# EAGLE design ChristmasOrnament (EAGLE 9.4.1)
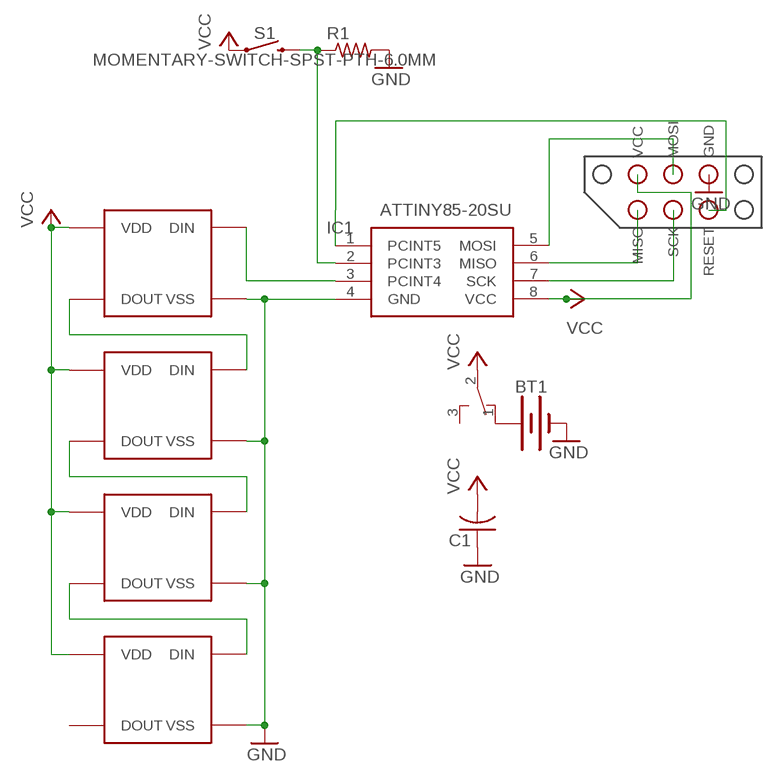
[diagram p0: schematic, sheet 1]

## Parts
BT1  BATTERY-20MM_SMD_4LEGS_OVERPASTE  [BATTCON_20MM_4LEGS_OVERPASTE]
C1  C-USC0402  [C0402]
IC1  ATTINY85-20SU  [SOT127P798X216-8N]
R1  R-US_R0402  [R0402]
S1  MOMENTARY-SWITCH-SPST-PTH-6.0MM  [TACTILE_SWITCH_PTH_6.0MM]
U$1  SK6812  [OSCL320P500X500X160-4N]
U$2  SK6812  [OSCL320P500X500X160-4N]
U$3  SK6812  [OSCL320P500X500X160-4N]
U$4  SK6812  [OSCL320P500X500X160-4N]
U$5  PROGRAMMING-PORT  [PROGRAMMING-PORT]
U$6  SLIDE-SWITCH  [SLIDE-SWITCH]

## Nets
GND: BT1.2(-) C1.1 IC1.4(GND) R1.2 U$1.3(VSS) U$2.3(VSS) U$3.3(VSS) U$4.3(VSS) U$5.P$6(GND)
N$1: U$1.2(DOUT) U$2.4(DIN)
N$2: U$2.2(DOUT) U$3.4(DIN)
N$3: U$3.2(DOUT) U$4.4(DIN)
N$4: IC1.1(PCINT5) U$5.P$5(RESET)
N$5: IC1.7(SCK) U$5.P$3(SCK)
N$6: IC1.3(PCINT4) U$1.4(DIN)
N$7: IC1.6(MISO) U$5.P$1(MISO)
N$8: IC1.5(MOSI) U$5.P$4(MOSI)
N$9: IC1.2(PCINT3) R1.1 S1.3
N$10: BT1.1(+) U$6.1
VCC: C1.2 IC1.8(VCC) S1.1 U$1.1(VDD) U$2.1(VDD) U$3.1(VDD) U$4.1(VDD) U$5.P$2(VCC) U$6.2
Unconnected: U$4.2(DOUT) U$6.3

## Library data of the parts
BT1 = SparkFun-Batteries:BATTERY: Battery - Single Cell A variety of battery chemistries, sizes, and footprints. Device List: 20MM_PTH - Coin Cell Battery Holder - 20mm (PTH) <https://www.sparkfun.com/products/783> 6.8MM_PTH - Coin Cell Battery Holder - 6.8MM(SMD) <https://www.digikey.com/product-detail/en/seiko-instruments/MS621FE-FL11E/728-1057-ND/1889208?WT.srch=1&gclid=CNOQ5a6LzdQCFZS2wAodXCkE0g> 12MM_SMD - Coin Cell Battery Holder - 12mm (SMD) <https://www.sparkfun.com/products/10592> 12MM_PTH - Coin Cell Battery Holder - 12mm (PTH) <https://www.sparkfun.com/products/7948> 20MM_SMD - 20mm Coin Cell Battery Holder (SMD) (2 legs) Used on the Big Time Watch Kit <https://www.sparkfun.com/products/11734> 20MM_SMD_4LEGS - Coin Cell Battery Holder - 20mm (SMD) <https://www.sparkfun.com/products/11892> 20MM_SMD_4LEGS_OVERPASTE - Coin Cell Battery Holder - 20mm (SMD) <https://www.sparkfun.com/products/11892> (Over-paste on the legs) 24.5MM_PTH - Coin Cell Battery Holder - 24.5mm (PTH) <https://www.sparkfun.com/products/8863> 9V - 9V Battery Holder - PC Mount Used on the SparkFun SparkPunk Sound Kit <https://www.sparkfun.com/products/11177> and SparkFun SparkPunk Sequencer Kit <https://www.sparkfun.com/products/12707> 18650 - Battery Holder - 18650 (PTH) <https://www.sparkfun.com/products/13113> AA - Battery Holder - 1xAA (PTH) <https://www.sparkfun.com/products/7949> AAA - Battery Holder - 1xAAA (PTH) <https://www.sparkfun.com/products/12718> AA_KIT - Battery Holder - 1xAA (PTH) <https://www.sparkfun.com/products/7949> Special kit package - pads only have exposed copper on one side of the board. AAA_KIT - Battery Holder - 1xAAA (PTH) <https://www.sparkfun.com/products/12718> Special kit package - pads only have exposed copper on one side of the board.; PROD_ID: PRT-11892; SF_SKU: BATT-10373
C1 = rcl:C-US: CAPACITOR, American symbol; SPICEPREFIX: C
IC1 = ATTINY85-20SU:ATTINY85-20SU: MICROCHIP - ATTINY85-20SU - MICROCONTROLLER MCU, 8 BIT, ATTINY, 20MHZ, SOIC-8 Source: Datasheet <https://componentsearchengine.com/Datasheets/1/ATTINY85-20SU.pdf>; DESCRIPTION: MICROCHIP - ATTINY85-20SU - MICROCONTROLLER MCU, 8 BIT, ATTINY, 20MHZ, SOIC-8; HEIGHT: 2.16mm; MANUFACTURER_NAME: Microchip; MANUFACTURER_PART_NUMBER: ATTINY85-20SU; MOUSER_PART_NUMBER: 556-ATTINY85-20SU; MOUSER_PRICE-STOCK: https://www.mouser.com/Search/Refine.aspx?Keyword=556-ATTINY85-20SU
R1 = rcl:R-US_: RESISTOR, American symbol; SPICEPREFIX: R
S1 = SparkFun-Switches:MOMENTARY-SWITCH-SPST: Momentary Switch (Pushbutton) - SPST Normally-open (NO) SPST momentary switches (buttons, pushbuttons). Variants PTH-12MM - 12mm square, through-hole Momentary Pushbutton Switch - 12mm Square <https://www.sparkfun.com/products/9190> (COM-09190) PTH-6.0MM, PTH-6.0MM-KIT - 6.0mm square, through-hole Mini Pushbutton Switch <https://www.sparkfun.com/products/97> (COM-00097) KIT package intended for soldering kit's - only one side of pads' copper is exposed. PTH-RIGHT-ANGLE-KIT - Right-angle, through-hole Right Angle Tactile Button <https://www.sparkfun.com/products/10791> - Used on SparkFun BigTime Watch Kit <https://www.sparkfun.com/products/11734> SMD-12MM - 12mm square, surface-mount Tactile Button - SMD (12mm) <https://www.sparkfun.com/products/12993> (COM-12993) Used on SparkFun PicoBoard <https://www.sparkfun.com/products/11888> SMD-4.5MM - 4.5mm Square Trackball Switch Used on SparkFun Blackberry Trackballer Breakout <https://www.sparkfun.com/products/13169> SMD-4.6MMX2.8MM - 4.60mm x 2.80mm, surface mount Used on SparkFun SAMD21 Mini Breakout <https://www.sparkfun.com/products/13664> SMD-5.2MM, SMD-5.2-REDUNDANT - 5.2mm square, surface-mount Mini Pushbutton Switch - SMD <https://www.sparkfun.com/products/8720> (COM-08720) Used on Arduino Pro Mini <https://www.sparkfun.com/products/11114> REDUNDANT package connects both switch circuits together SMD-6.0X3.5MM - 6.0 x 3.5mm, surface mount Momentary Reset Switch SMD <https://www.sparkfun.com/products/8229> (COM-08229) SMD-6.2MM-TALL - 6.2mm square, surface mount Tactile Button - SMD (6mm) <https://www.sparkfun.com/products/12992> Used on SparkFun Digital Sandbox <https://www.sparkfun.com/products/12651> SMD-RIGHT-ANGLE - Right-angle, surface mount Used on SparkFun Block for Intel® Edison - Arduino <https://www.sparkfun.com/products/13036>; PROD_ID: SWCH-08441; SF_SKU: COM-00097
U$1-U$4 = ATTINY85-20SU:SK6812
U$5 = ATTINY85-20SU:PROGRAMMING-PORT
U$6 = Main:SLIDE-SWITCH

## Board
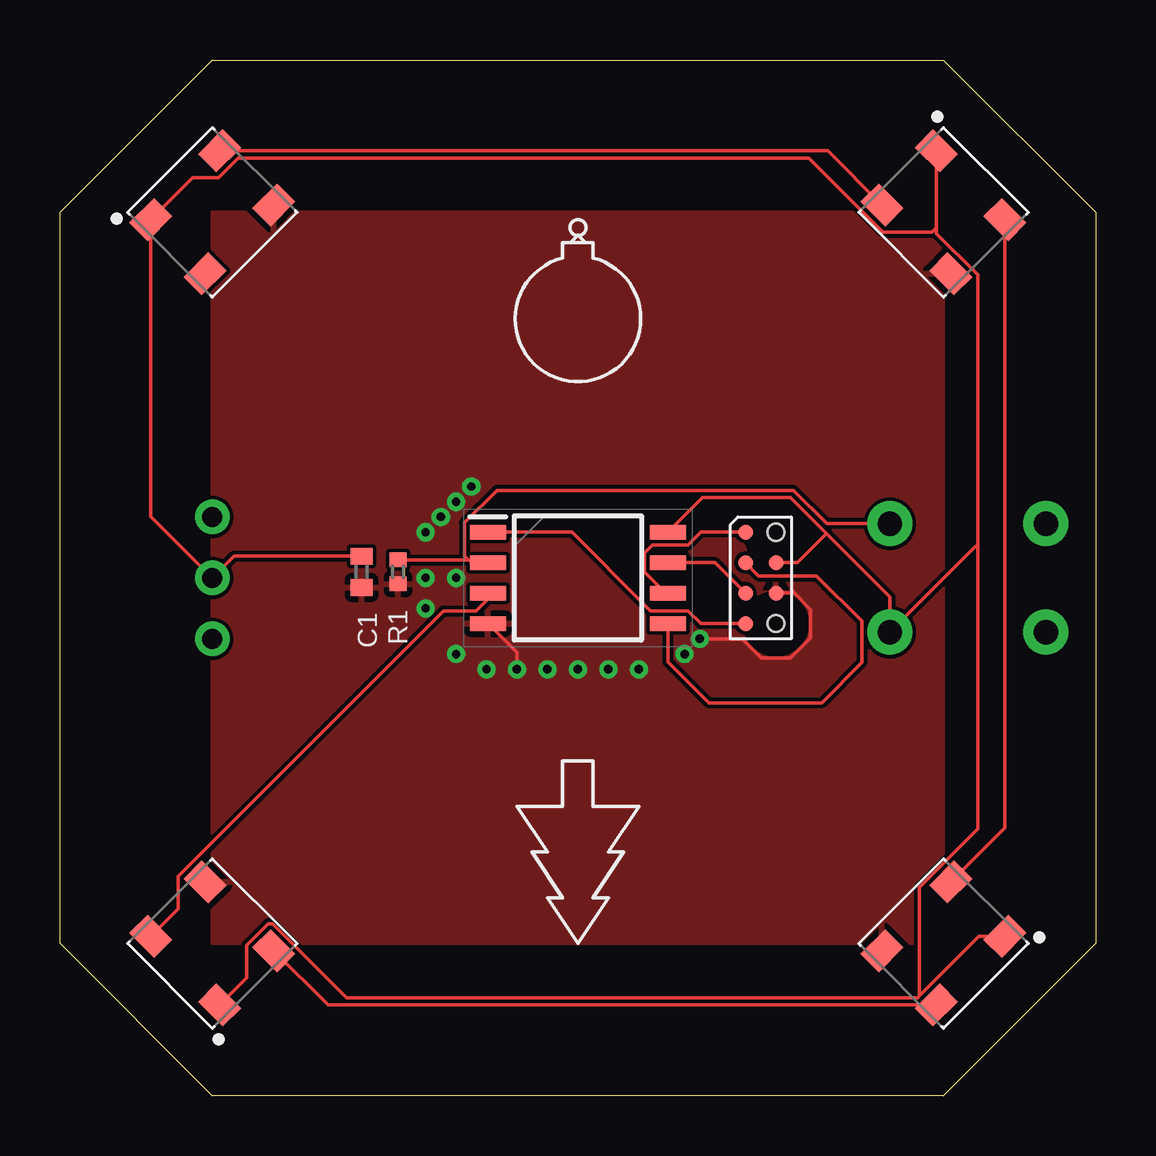
[diagram p1: board, top side]
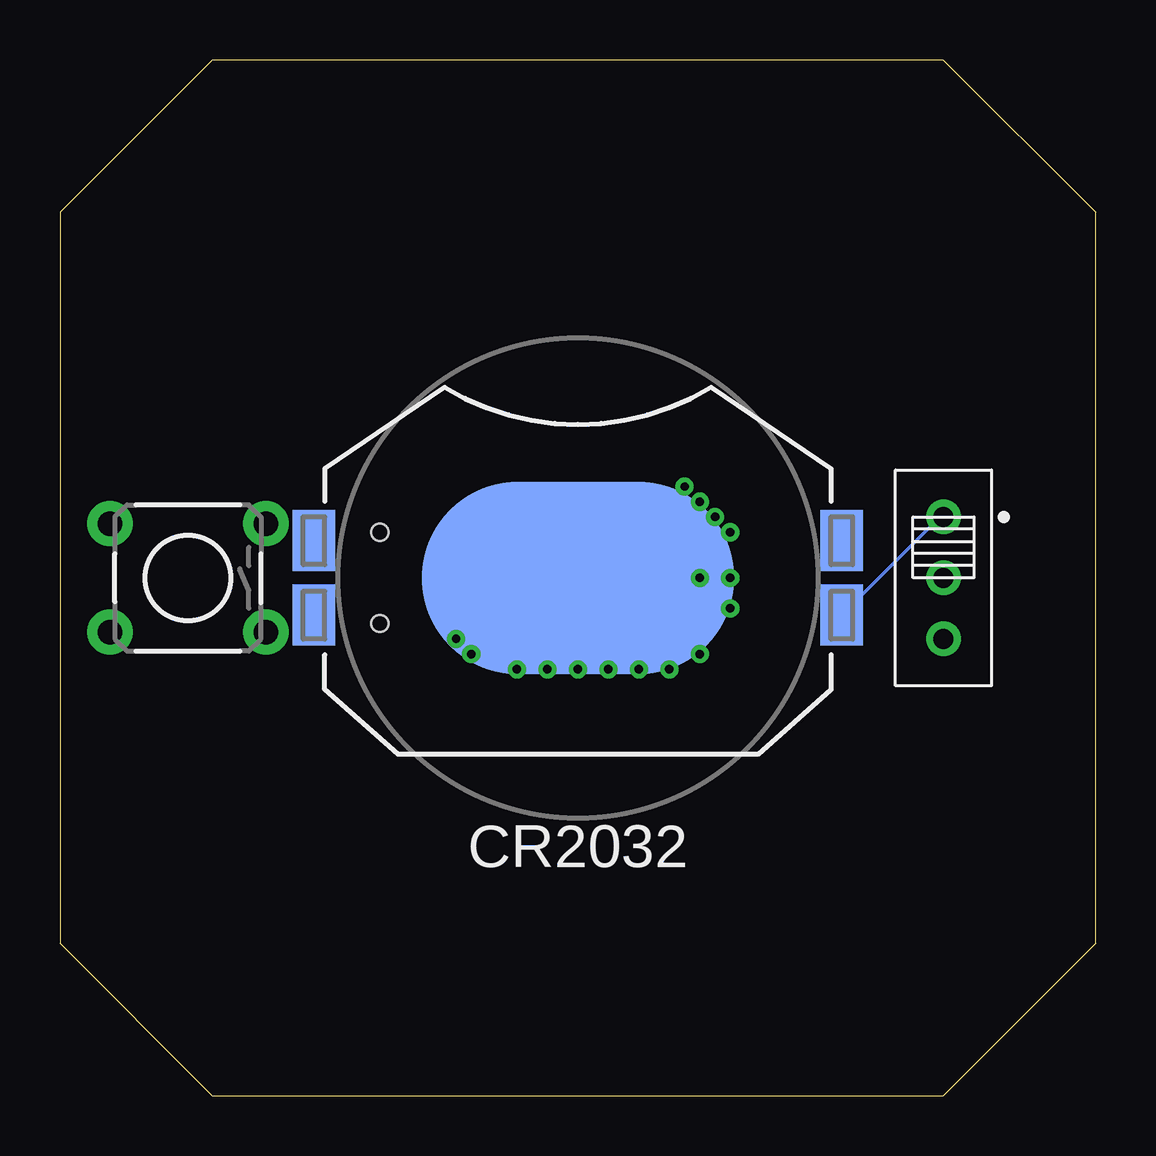
[diagram p2: board, bottom side, seen from below]

Size 43.18 x 43.18 mm. Coordinates in mm from the lower left corner, seen from the top.
Outline: 6.35,43.18 0,36.83 0,6.35 6.35,0 36.83,0 43.18,6.35 43.18,36.83 36.83,43.18 6.35,43.18
Copper layers (1*16): Top 0.035mm / dielectric 1.5mm / Bottom 0.035mm
Design rules "default": minimum track width 6mil, minimum drill 0.35mm, track to track 6mil, track to pad 6mil, pad to pad 6mil, via to via 6mil, smd to smd 6mil, copper to edge 40mil, drill to drill 6mil, minimum pad ring 10mil, minimum via ring 8mil, stop-mask expansion 4mil, vias tented up to drill 0mil, thermal gap 10mil

### Footprints (pad centres in the part's own frame; a part is rotated, then mirrored left to right if it is on the bottom)
BATTCON_20MM_4LEGS_OVERPASTE = smd 1.778 x 2.54: 1 -11,1.55; 3 11,1.55; P$1 -11,-1.55; P$2 11,-1.55 | smd 13 x 8: 2 0,0
C0402 = smd 0.7 x 0.9: 1 -0.65,0; 2 0.65,0
SOT127P798X216-8N = smd 1.5 x 0.6: 1 -3.75,1.905; 2 -3.75,0.635; 3 -3.75,-0.635; 4 -3.75,-1.905; 5 3.75,-1.905; 6 3.75,-0.635; 7 3.75,0.635; 8 3.75,1.905
R0402 = smd 0.6 x 0.7: 1 -0.5,0; 2 0.5,0
TACTILE_SWITCH_PTH_6.0MM = drill 1.016 pad 1.88: 1 -3.251,2.261; 2 3.251,2.261; 3 -3.251,-2.261; 4 3.251,-2.261
OSCL320P500X500X160-4N = smd 1.462 x 1.072: 1 -2.025,1.6; 2 -2.025,-1.6; 3 2.025,-1.6; 4 2.025,1.6
PROGRAMMING-PORT = smd 0.635 x 0.635: P$1 -1.905,-0.635; P$2 -0.635,0.635; P$3 0.635,-0.635; P$4 -0.635,-0.635; P$5 1.905,-0.635; P$6 0.635,0.635 | hole 0.7: -1.905,0.635; 1.905,0.635
SLIDE-SWITCH = drill 0.836 pad 1.436: 1 0,0; 2 2.54,0; 3 5.08,0

### Placement (x,y rotation side)
BT1  21.59,21.59 180 bottom
C1  12.57,21.84 90 top
IC1  21.59,21.59 0 top
R1  14.1,21.84 270 top
S1  37.85,21.59 180 bottom
U$1  6.35,6.35 135 top
U$2  36.83,6.35 225 top
U$3  36.83,36.83 315 top
U$4  6.35,36.83 45 top
U$5  29.21,21.59 270 top
U$6  6.35,24.13 270 bottom

### Tracks (layer width: path | path; a pad name or v marks a point on that pad's centre or on a via)
GND  (via drill 0.35)
  Top 0.152: IC1.4 19.05,18.47 v19.05,17.78 | U$5.P$6 30.48,20.95 30.55,21.02 31.29,20.28 31.29,19.09 30.44,18.24 29.25,18.24 28.44,19.05 v26.67,19.05
  Bottom 0.152: BT1.2 24.13,19.05 v24.13,17.78 | BT1.2 20.95,21.59 BT1.2 | BT1.2 24.76,18.41 v26.04,18.41
  other vias: 17.78,17.78 20.32,17.78 21.59,17.78 22.86,17.78 16.51,18.41 15.24,20.32 15.24,21.59 16.51,21.59 15.24,23.49 15.88,24.13 16.51,24.76 17.14,25.4
  pour Top: 6.35,36.83 36.83,36.83 36.83,6.35 6.35,6.35
N$1
  Top 0.152: U$2.4 11.18,3.79 U$1.2
N$2
  Top 0.152: U$2.2 39.39,11.18 U$3.4
N$3
  Top 0.152: U$3.2 32,39.39 U$4.4
N$4
  Top 0.152: IC1.1 21.34,23.49 24.38,20.45 24.62,20.21 26.18,20.21 26.71,19.68 U$5.P$5
N$5
  Top 0.152: IC1.7 27.3,22.22 U$5.P$3
N$6
  Top 0.152: IC1.3 17.84,20.7 17.35,20.21 15.99,20.21 4.92,9.15 4.92,7.79 U$1.4
N$7
  Top 0.152: 25.24,20.95 IC1.6 25.24,20.95 | 25.24,20.95 24.36,21.83 24.36,21.84 24.36,22.62 24.71,22.97 26.18,22.97 26.71,23.49 U$5.P$1
N$8
  Top 0.152: IC1.5 25.34,18.09 27.05,16.38 31.75,16.38 33.43,18.06 33.43,19.79 31.53,21.68 29.12,21.68 U$5.P$4
N$9
  Top 0.152: S1.3 31.96,23.85 30.57,25.24 18.21,25.24 16.86,23.89 16.86,22.51 17.27,22.1 17.71,22.1 IC1.2 17.72,22.34 R1.1
N$10
  Bottom 0.152: BT1.1 6.5,24.13 U$6.1
VCC
  Top 0.152: IC1.8 26.78,24.94 30.44,24.94 31.94,23.43 | 31.94,23.43 34.59,20.79 S1.1 38.11,22.85 38.26,22.99 | C1.2 7.25,22.49 U$6.2 3.79,24.15 U$4.1 5.53,38.27 6.61,38.27 7.43,39.09 31.23,39.09 34.21,36.11 | U$5.P$2 30.73,22.22 31.94,23.43 | 34.21,36.11 34.31,36.01 | 38.26,22.99 38.26,34.22 36.53,35.95 36.53,36.2 | 36.53,36.2 U$3.1 | 34.21,36.11 34.31,36.01 | 34.31,36.01 36.34,36.01 36.53,36.2 | U$1.1 7.79,4.92 7.79,6.28 8.68,7.17 8.87,7.17 11.95,4.09 35.75,4.09 35.83,4.17 | U$2.1 38.31,6.65 35.83,4.17 | 38.26,22.99 38.26,11.12 35.83,8.7 35.83,4.17

### Text on the board
bNames: CR2032